# Altium schematic sheet AMU-S26-V00-DAUGHTERShutdown.SchDoc: Shutdown Chain
size A3; Date: 10/07/2020; DrawnBy: Alikhan Hassan; DocumentNumber: 5; Revision: 00; SheetNumber: 22; SheetTotal: 25; Project: IMD Daughter Board 2020; Version: 01
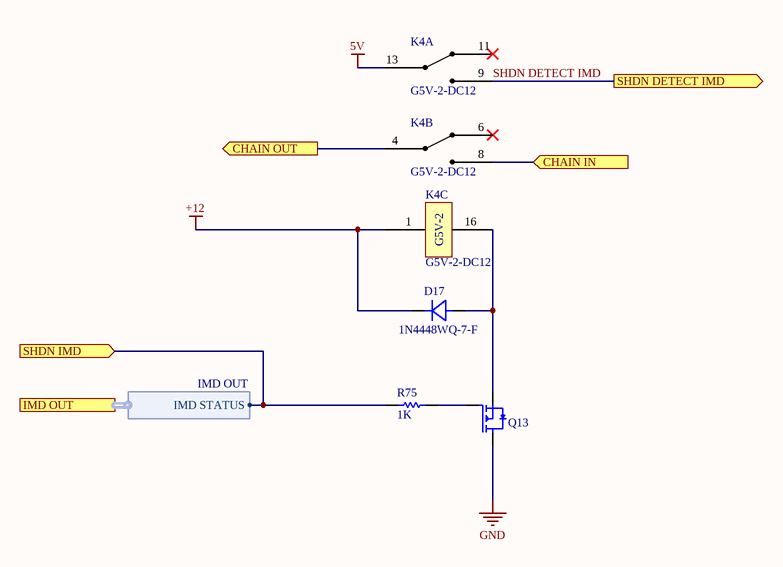
[diagram p0: AMU-S26-V00-DAUGHTERShutdown.SchDoc]

## Parts
D17  1N4448WQ-7-F  [SMA]
K4  G5V-2-DC12  [G5V-2]  (parts A,B,C of 3)
Q13  (no value)  [PMV15UNEAR]
R75  1K  [Res_ThinFilm_0603]

## Ports
CHAIN IN (in), CHAIN OUT (out), IMD OUT (harness IMD OUT), SHDN DETECT IMD (out), SHDN IMD (in)

## Harnesses
IMD OUT: IMD STATUS

## Nets
5V: K4.13
+12: D17.K(Cathode) K4.1
GND: Q13.D(Drain)
CHAIN IN: K4.8 ; port CHAIN IN
CHAIN OUT: K4.4 ; port CHAIN OUT
SHDN DETECT IMD: K4.9 ; port SHDN DETECT IMD
SHDN IMD: R75.1 ; port SHDN IMD, port IMD OUT.IMD STATUS
NetD17_A: D17.A(Anode) K4.16 Q13.S(Source)
NetQ13_G: Q13.G(Gate) R75.2

Not connected (* = marked no-connect by the designer): K4 6* 11*

## Notes on the sheet
- Revision History:
- Sheet Title:
- Rev
- Date
- Description
- Project:
- Size:
- Drawn By:
- A3
- Number:
- Revision:
- Sheet
- Version:
- of
- QUT Motorsport
- O-120, Gardens Point
- 2 George Street
- Brisbane, QLD 4000
- Australia
- Print Date:
- Print Time:
- File Name:
- (in symbol G5V-2-DC12, part C) G5V-2

## Library data of the parts
D17 = 1N4448WQ-7-F: Diode, SMD, 75V, 5%, 250mA, SOD123; Manufacturer: ON Semiconductor / Fairchild; Manufacturer Part Number: 1N914BWS; Average Rectified Current: 150mA; Element Configuration: Single; Forward Voltage: 1V; Max Reverse Leakage Current: 5uA; Power Dissipation: 200mW; Recovery Time: 4ns; Max Forward Surge Current (Ifsm): 4A; Parameter 1: *; Weight: 0.0276g; Category: Rectifier Diodes; Contact Plating: Tin,Matte; Forward Current: 150mA; Lead Free: Lead Free; Max Operating Temperature: 150°C; Max Repetitive Reverse Voltage (Vrrm): 75V; Max Reverse Voltage (DC): 75V; Min Operating Temperature: -55°C; Mount: Surface Mount; Number of Pins: 2; Package Quantity: 1; Packaging: Tape and Reel; Peak Reverse Current: 5uA; Radiation Hardening: No; REACH SVHC: No SVHC; Reverse Recovery Time: 4ns; Height: 1mm; Length: 1.8mm; Reverse Voltage: 75V; Width: 1.35mm
K4 = G5V-2-DC12: General Purpose Relay DPDT (2 Form C) Through Hole, 12V, 2A
Q13 = PMV15UNEAR: MOSFET N-CH, 20V, SOT23; Manufacturer: Nexperia
R75 = 1k 5% 0603: Resistor, SMD, 1k, 0.1W, 5%, 0603